# Altium schematic sheet CC-S09-V00-PSU-3V3.SchDoc: Power Supply (9-25V to 3v3 @ 0.1-0.3A)
size A3; DrawnBy: Jonn Dillon; DocumentNumber: 10; Revision: 01; SheetNumber: 10; SheetTotal: 13; Version: 01; Project: Chassis Controller (Interim) 2020; PageSetup: Record=PageOptions|CenterHorizontal=True|CenterVertical=True|PrintScale=0.97|XCorrection=1.00|YCorrection=1.00|PrintKind=0|BorderSize=5000000|LeftOffset=0|BottomOffset=0|Orientation=2|PaperLength=1000|PaperWidth=1000|Scale=100|PaperSource=7|PrintQuality=-4|MediaType=1|DitherType=10|PaperKind=A4|PrintScaleMode=1
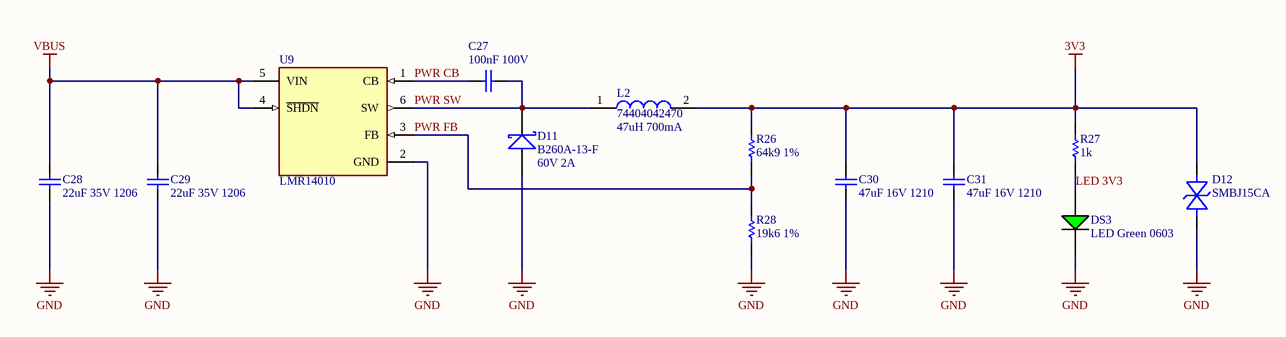
[diagram p0: CC-S09-V00-PSU-3V3.SchDoc]

## Parts
C27  100nF 100V  [Cap_Ceramic_0603]
C28  22uF 35V 1206  [Cap_Ceramic_1206]
C29  22uF 35V 1206  [Cap_Ceramic_1206]
C30  47uF 16V 1210  [Cap_Ceramic_1210]
C31  47uF 16V 1210  [Cap_Ceramic_1210]
D11  B260A-13-F  [SMA]
D12  SMBJ15CA  [SMB]
DS3  LED Green 0603  [LED GREEN 0603]
L2  74404042470  [INDUCTOR_4X3MM_1.8MM]
R26  64k9 1%  [Res_ThinFilm_0603]
R27  1k  [Res_ThinFilm_0603]
R28  19k6 1%  [Res_ThinFilm_0603]
U9  LMR14010  [LMR14010]

## Nets
3V3: C30.2 C31.2 D12.K(Cathode) L2.2 R26.2 R27.2
GND: C28.1 C29.1 C30.1 C31.1 D11.A D12.A(Anode) DS3.2(C) R28.1 U9.2(GND)
VBUS: C28.2 C29.2 U9.4(~{SHDN}) U9.5(VIN)
LED 3V3: DS3.1(A) R27.1
PWR CB: C27.1 U9.1(CB)
PWR FB: R26.1 R28.2 U9.3(FB)
PWR SW: C27.2 D11.K L2.1 U9.6(SW)

## Notes on the sheet
- (near L2) 47uH 700mA
- (near D11) 60V 2A
- Revision History:
- Sheet Title:
- Rev
- Date
- Description
- Project:
- Size:
- Drawn By:
- A3
- Number:
- Revision:
- Sheet
- Version:
- of
- QUT Motorsport
- O-120, Gardens Point
- 2 George Street
- Brisbane, QLD 4000
- Australia
- Print Date:
- Print Time:
- File Name:

## Library data of the parts
C27 = 100nF 100V 5% X7R 0603: Capacitor, Ceramic, SMD, 100nF, 100V, 5%, X7R, 0603
C28 C29 = 22uF 35V 10% X7R 1206: Capacitor, Ceramic, SMD, 22uF, 35V, 10%, X7R, 1206
C30 C31 = 47uF 16V 10% X7R 1210: Capacitor, Ceramic, SMD, 47uF, 16V, 5%, X7R, 1210
D11 = B260A-13-F: Diode, Schottky Barrier Rectifier, 60 V, 2 A, B260A-13-F
D12 = SMBJ15CA: Diode, SMD, TVS Diode, 15V 24.4V, DO214AA/SMB; ComponentLink1Description: Digikey; ComponentLink1URL: https://www.digikey.com.au/product-detail/en/littelfuse-inc/SMBJ15CA/SMBJ15CALFCT-ND/285983; ComponentLink2Description: Datasheet; ComponentLink2URL: https://www.littelfuse.com/~/media/electronics/datasheets/tvs_diodes/littelfuse_tvs_diode_smbj_datasheet.pdf.pdf
L2 = 74404042470: 47µH Semi-Shielded Wirewound Inductor 600mA 620mOhm Nonstandard; ComponentLink1Description: Digikey; ComponentLink1URL: https://www.digikey.com/product-detail/en/w%C3%BCrth-elektronik/74404042470/732-5512-1-ND/4865405; ComponentLink2Description: LCSC A; ComponentLink2URL: https://lcsc.com/product-detail/Power-Inductors_Sunlord-SWPA6045S221MT_C91047.html; ComponentLink3Description: LCSC B; ComponentLink3URL: https://lcsc.com/product-detail/Power-Inductors_SXN-Shun-Xiang-Nuo-Elec-SMNR6045-221MT_C467145.html
R26 = 64k9 1% 0603: Resistor, SMD, 64k9, 0.1W, 5%, 0603
R27 = 1k 5% 0603: Resistor, SMD, 1k, 0.1W, 5%, 0603
R28 = 19k6 1% 0603: Resistor, SMD, 19k6, 0.1W, 5%, 0603